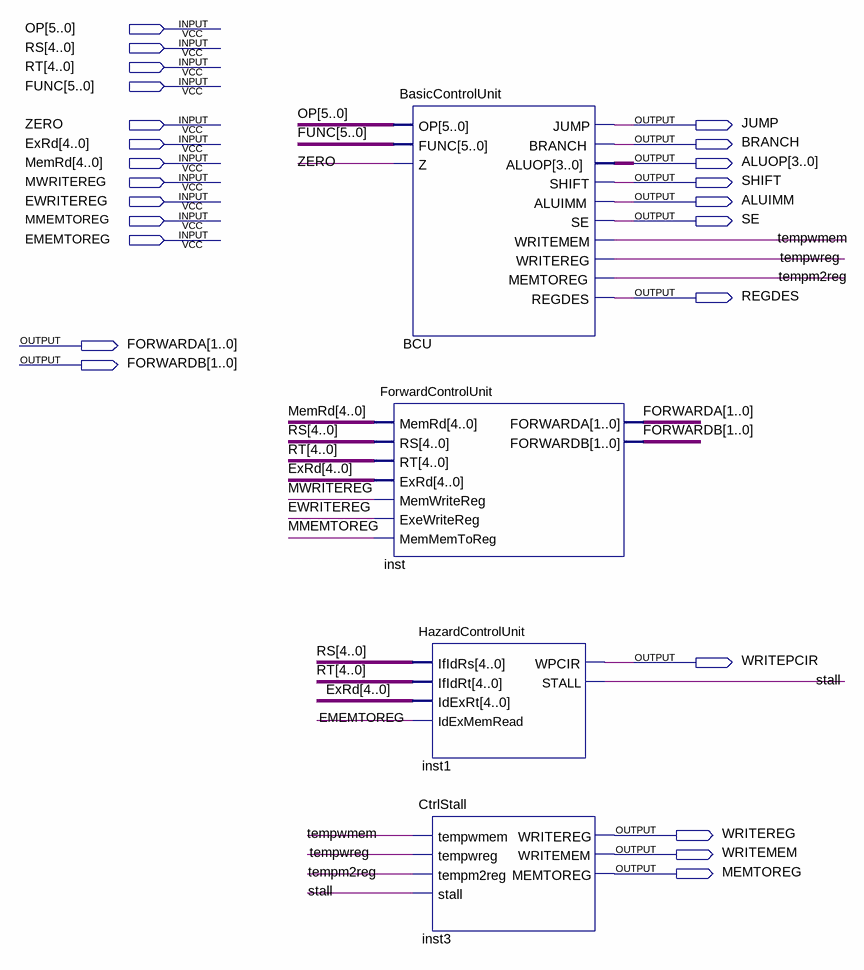
[diagram p0: schematic sheet]
// Quartus schematic ControlUnit.bdf as structural Verilog: 4 symbols, 24 pins
module ControlUnit (
  input  [5:0] OP,
  input  [4:0] RS,
  input  [4:0] RT,
  input  [5:0] FUNC,
  input  ZERO,
  input  [4:0] ExRd,
  input  [4:0] MemRd,
  input  MWRITEREG,
  input  EWRITEREG,
  input  MMEMTOREG,
  input  EMEMTOREG,
  output JUMP,
  output BRANCH,
  output [3:0] ALUOP,
  output SHIFT,
  output ALUIMM,
  output SE,
  output REGDES,
  output [1:0] FORWARDA,
  output [1:0] FORWARDB,
  output WRITEPCIR,
  output WRITEREG,
  output WRITEMEM,
  output MEMTOREG
);

  wire stall, tempm2reg, tempwmem, tempwreg;

  BasicControlUnit BCU (
    .OP(OP), .FUNC(FUNC), .Z(ZERO), .JUMP(JUMP), .BRANCH(BRANCH), .ALUOP(ALUOP), .SHIFT(SHIFT),
    .ALUIMM(ALUIMM), .SE(SE), .WRITEMEM(tempwmem), .WRITEREG(tempwreg), .MEMTOREG(tempm2reg), .REGDES(REGDES));
  ForwardControlUnit inst (
    .MemRd(MemRd), .RS(RS), .RT(RT), .ExRd(ExRd), .MemWriteReg(MWRITEREG), .ExeWriteReg(EWRITEREG),
    .MemMemToReg(MMEMTOREG), .FORWARDA(FORWARDA), .FORWARDB(FORWARDB));
  HazardControlUnit inst1 (
    .IfIdRs(RS), .IfIdRt(RT), .IdExRt(ExRd), .IdExMemRead(EMEMTOREG), .WPCIR(WRITEPCIR), .STALL(stall));
  CtrlStall inst3 (
    .tempwmem(tempwmem), .tempwreg(tempwreg), .tempm2reg(tempm2reg), .stall(stall), .WRITEREG(WRITEREG),
    .WRITEMEM(WRITEMEM), .MEMTOREG(MEMTOREG));
endmodule
